# Altium schematic sheet Top_Level_SCH.SchDoc
size A
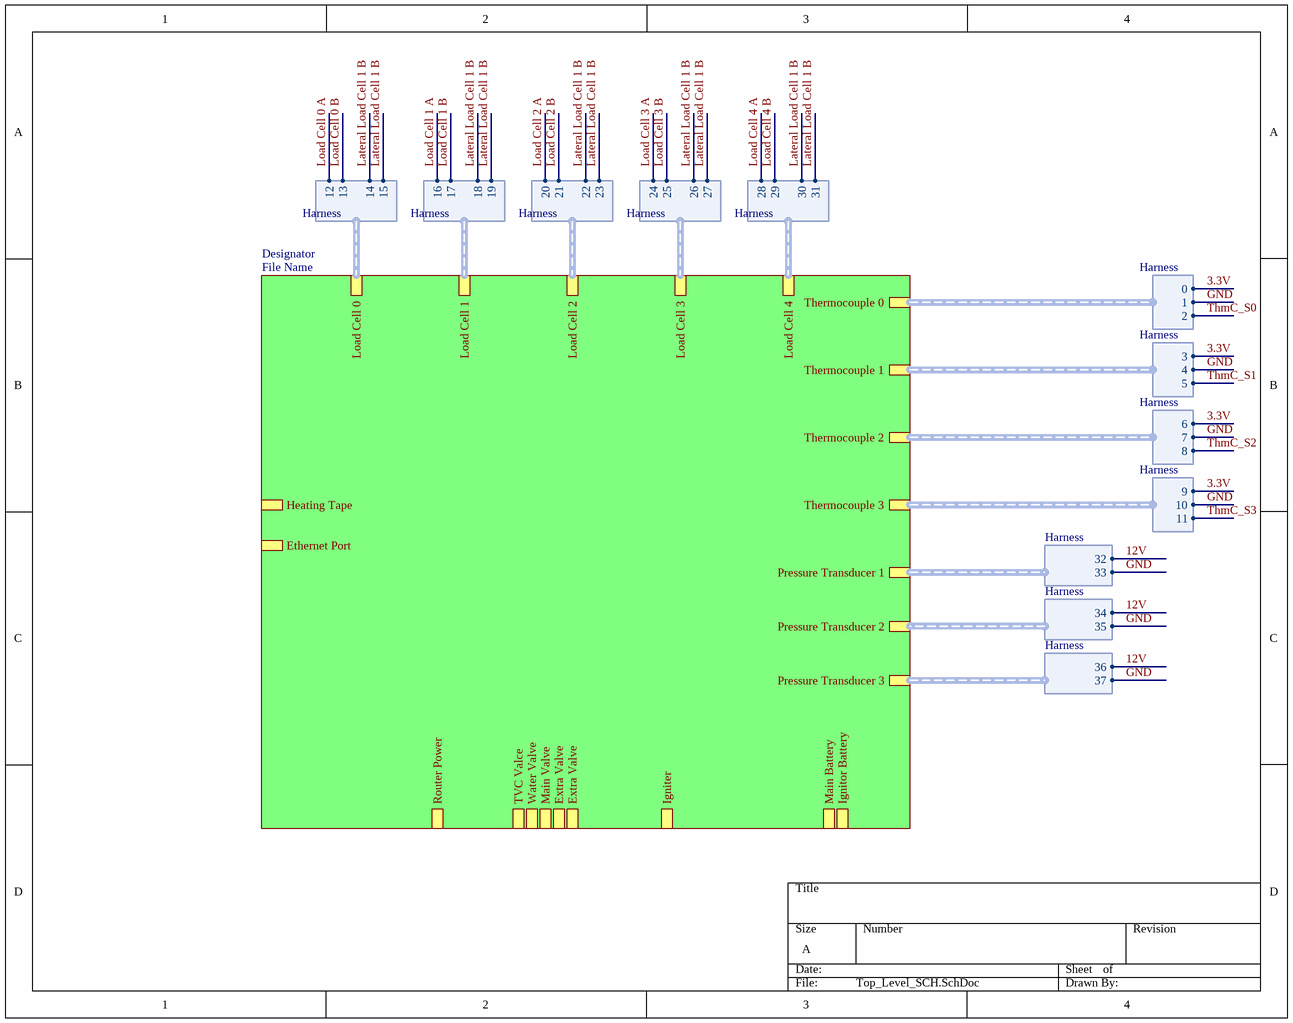
[diagram p0: Top_Level_SCH.SchDoc]

## Sub-sheets
Designator = File Name: Thermocouple 0 (harness Harness), Thermocouple 1 (harness Harness), Thermocouple 2 (harness Harness), Pressure Transducer 1 (harness Harness), Pressure Transducer 2 (harness Harness), Pressure Transducer 3 (harness Harness), Ignitor Battery, Main Battery, Igniter, Main Valve, Water Valve, TVC Valce, Router Power, Extra Valve, Extra Valve, Heating Tape, Thermocouple 3 (harness Harness), Ethernet Port, Load Cell 4 (harness Harness), Load Cell 3 (harness Harness), Load Cell 2 (harness Harness), Load Cell 1 (harness Harness), Load Cell 0 (harness Harness)

## Harnesses
Harness: 0, 1, 2
Harness: 3, 4, 5
Harness: 6, 7, 8
Harness: 9, 10, 11
Harness: 12, 13, 14, 15
Harness: 16, 17, 18, 19
Harness: 20, 21, 22, 23
Harness: 24, 25, 26, 27
Harness: 28, 29, 30, 31
Harness: 32, 33
Harness: 34, 35
Harness: 36, 37

## Nets
3.3V: sheet Designator/Thermocouple 0.0, sheet Designator/Thermocouple 1.3, sheet Designator/Thermocouple 2.6, sheet Designator/Thermocouple 3.9
12V: sheet Designator/Pressure Transducer 1.32, sheet Designator/Pressure Transducer 2.34, sheet Designator/Pressure Transducer 3.36
GND: sheet Designator/Thermocouple 0.1, sheet Designator/Thermocouple 1.4, sheet Designator/Thermocouple 2.7, sheet Designator/Thermocouple 3.10, sheet Designator/Pressure Transducer 1.33, sheet Designator/Pressure Transducer 2.35, sheet Designator/Pressure Transducer 3.37
Lateral Load Cell 1 B: sheet Designator/Load Cell 0.14, sheet Designator/Load Cell 0.15, sheet Designator/Load Cell 1.18, sheet Designator/Load Cell 1.19, sheet Designator/Load Cell 2.22, sheet Designator/Load Cell 2.23, sheet Designator/Load Cell 3.26, sheet Designator/Load Cell 3.27, sheet Designator/Load Cell 4.30, sheet Designator/Load Cell 4.31
Load Cell 0 A: sheet Designator/Load Cell 0.12
Load Cell 0 B: sheet Designator/Load Cell 0.13
Load Cell 1 A: sheet Designator/Load Cell 1.16
Load Cell 1 B: sheet Designator/Load Cell 1.17
Load Cell 2 A: sheet Designator/Load Cell 2.20
Load Cell 2 B: sheet Designator/Load Cell 2.21
Load Cell 3 A: sheet Designator/Load Cell 3.24
Load Cell 3 B: sheet Designator/Load Cell 3.25
Load Cell 4 A: sheet Designator/Load Cell 4.28
Load Cell 4 B: sheet Designator/Load Cell 4.29
ThmC_S0: sheet Designator/Thermocouple 0.2
ThmC_S1: sheet Designator/Thermocouple 1.5
ThmC_S2: sheet Designator/Thermocouple 2.8
ThmC_S3: sheet Designator/Thermocouple 3.11